# EAGLE design mLRS-rx-WioE5-E22-dual-v008 (EAGLE 7.5.0)
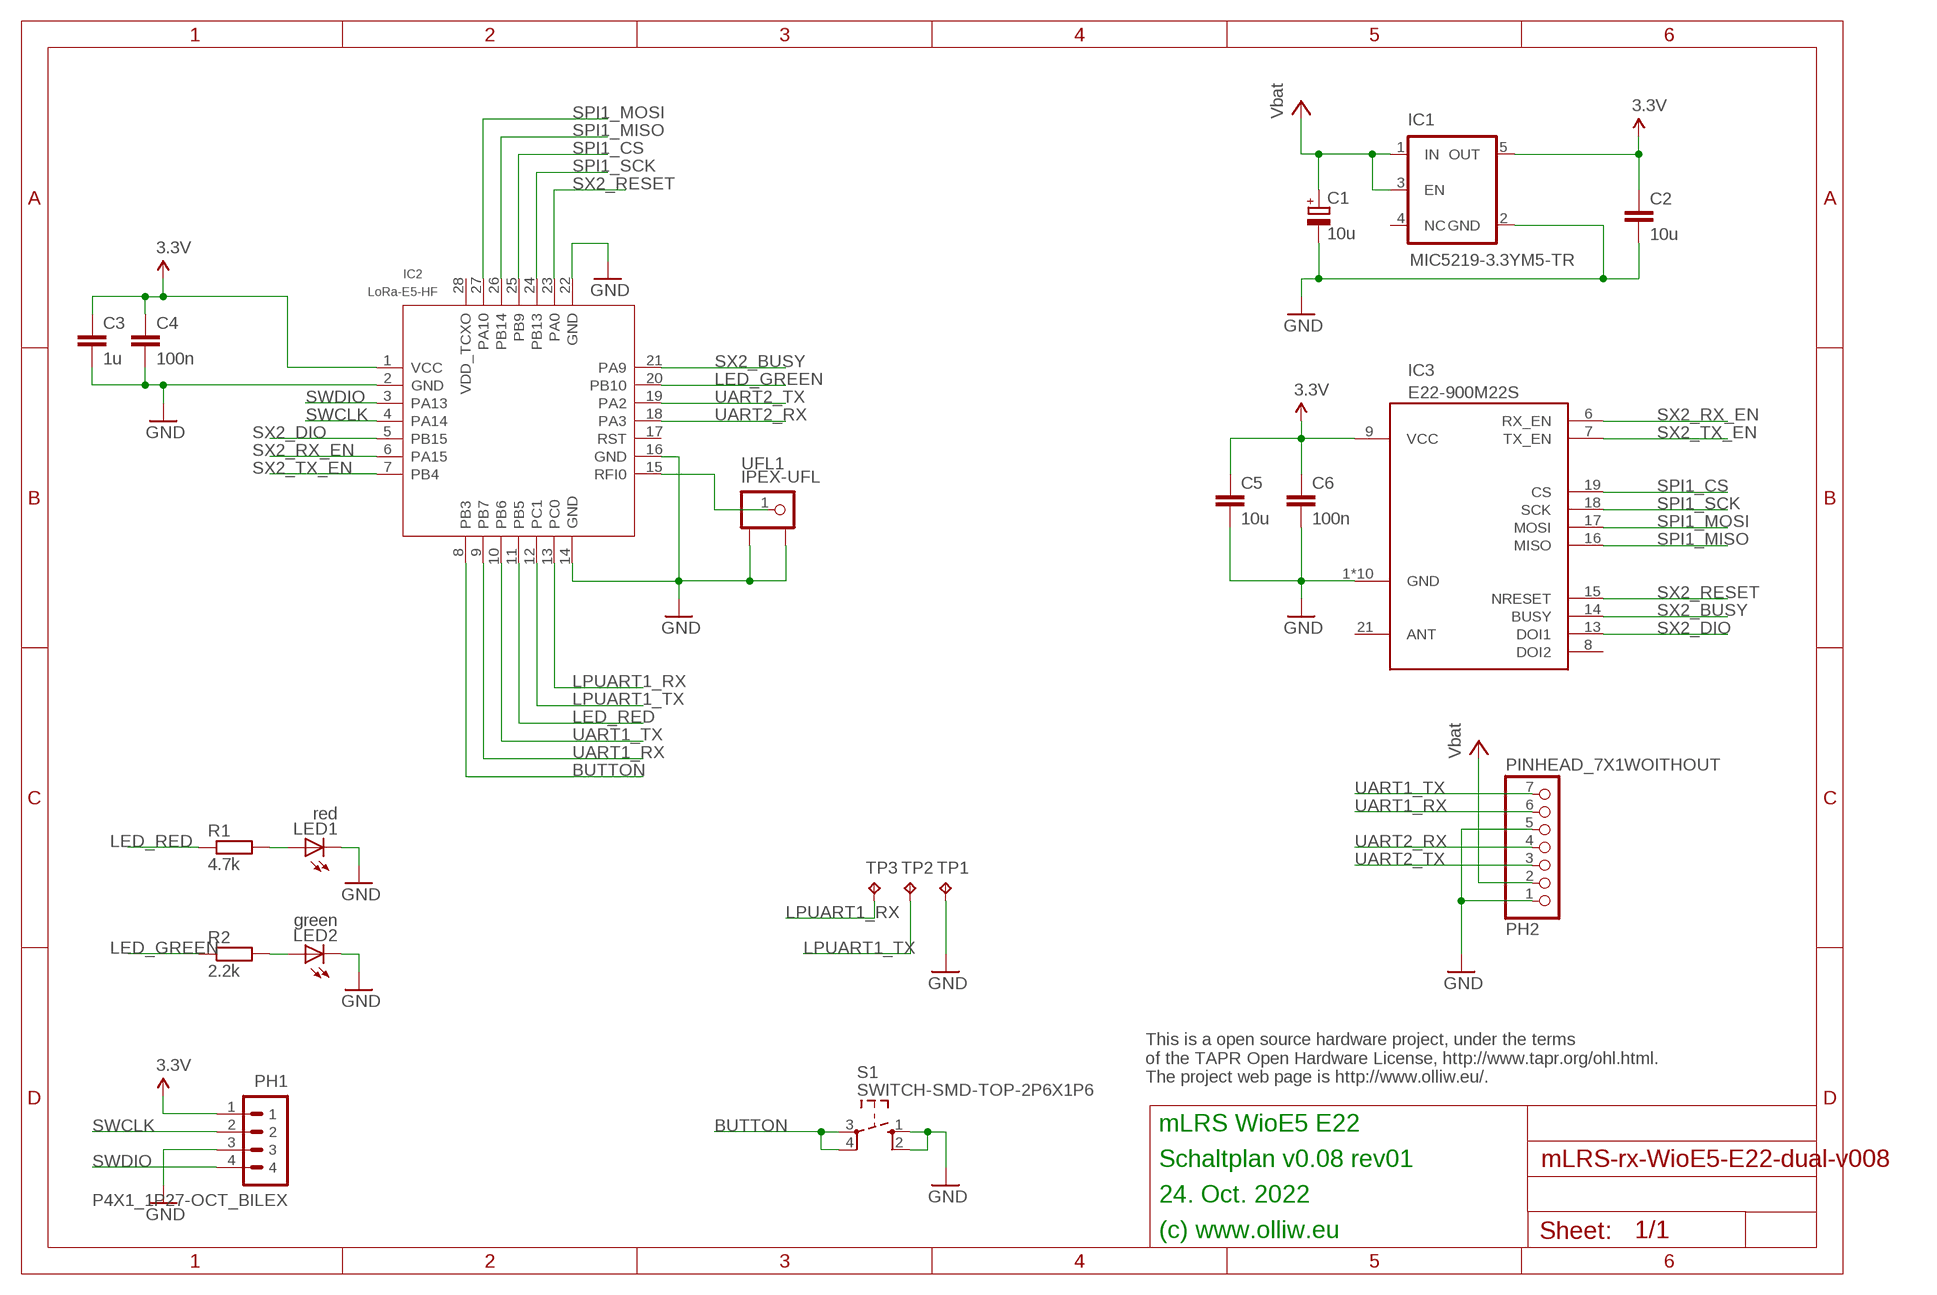
[diagram p0: schematic, sheet 1]

## Parts
C1  10u  CPOL-EUSMCA  [SMC_A]
C2  10u  C-EUC0805  [C0805]
C3  1u  C-EUC0603K  [C0603K]
C4  100n  C-EUC0402  [C0402]
C5  10u  C-EUC0805K  [C0805K]
C6  100n  C-EUC0402  [C0402]
IC1  MIC5219-3.3YM5-TR  V_REG_TPS76433SOT23-5  [SOT23-5]
IC2  LoRa-E5-HF  MOUDLE_LORA_E5  [MOUDLE28P-1.25-12X12X2.5MM]
IC3  E22-900M22S  [E22-900M22S]
LED1  red  LEDCHIPLED_0603  [CHIPLED_0603]
LED2  green  LEDCHIPLED_0603  [CHIPLED_0603]
PH1  P4X1_1P27-OCT_BILEX  [4X1_1P27_OCT_BILEX]
PH2  PINHEAD_7X1WOITHOUT  [PINHEAD_7X1_WO]
R1  4.7k  R-EU_R0402  [R0402]
R2  2.2k  R-EU_R0402  [R0402]
S1  SWITCH-SMD-TOP-2P6X1P6  [TACTILE-SWITCH-SMD-TOP-2P6X1X6]
TP1  TPB1,27  [B1,27]
TP2  TPB1,27  [B1,27]
TP3  TPB1,27  [B1,27]
UFL1  IPEX-UFL  [IPEX-UFL-SMD]

## Nets
3.3V: C2.1 C3.1 C4.1 C5.1 C6.1 IC1.5(OUT) IC2.1(VCC) IC3.9(VCC) PH1.1
BUTTON: IC2.8(PB3) S1.3 S1.4
GND: C1.- C2.2 C3.2 C4.2 C5.2 C6.2 IC1.2(GND) IC2.2(GND) IC2.14(GND) IC2.16(GND) IC2.22(GND) IC3.1(GND) IC3.2(GND) IC3.3(GND) IC3.4(GND) IC3.5(GND) IC3.10(GND) IC3.11(GND) IC3.12(GND) IC3.20(GND) IC3.22(GND) LED1.C LED2.C PH1.3 PH2.1 PH2.5 S1.1 S1.2 TP1.TP UFL1.2 UFL1.3
LED_GREEN: IC2.20(PB10) R2.1
LED_RED: IC2.11(PB5) R1.1
LPUART1_RX: IC2.13(PC0) TP3.TP
LPUART1_TX: IC2.12(PC1) TP2.TP
N$1: IC2.15(RFI0) UFL1.1
N$17: LED1.A R1.2
N$19: LED2.A R2.2
SPI1_CS: IC2.25(PB9) IC3.19(CS)
SPI1_MISO: IC2.26(PB14) IC3.16(MISO)
SPI1_MOSI: IC2.27(PA10) IC3.17(MOSI)
SPI1_SCK: IC2.24(PB13) IC3.18(SCK)
SWCLK: IC2.4(PA14) PH1.2
SWDIO: IC2.3(PA13) PH1.4
SX2_BUSY: IC2.21(PA9) IC3.14(BUSY)
SX2_DIO: IC2.5(PB15) IC3.13(DOI1)
SX2_RESET: IC2.23(PA0) IC3.15(NRESET)
SX2_RX_EN: IC2.6(PA15) IC3.6(RX_EN)
SX2_TX_EN: IC2.7(PB4) IC3.7(TX_EN)
UART1_RX: IC2.9(PB7) PH2.6
UART1_TX: IC2.10(PB6) PH2.7
UART2_RX: IC2.18(PA3) PH2.4
UART2_TX: IC2.19(PA2) PH2.3
VCC: C1.+ IC1.1(IN) IC1.3(EN) PH2.2 ; supply symbol labelled Vbat
Unconnected: IC1.4(NC) IC2.17(RST) IC2.28(VDD_TCXO) IC3.8(DOI2) IC3.21(ANT)

## Notes on the sheet
- This is a open source hardware project, under the terms
  of the TAPR Open Hardware License, http://www.tapr.org/ohl.html.
  The project web page is http://www.olliw.eu/.
- mLRS WioE5 E22
- Schaltplan v0.08 rev01
- 24. Oct. 2022
- (c) www.olliw.eu

## Library data of the parts
C1 = rcl:CPOL-EU: POLARIZED CAPACITOR, European symbol
C2-C6 = rcl:C-EU: CAPACITOR, European symbol
IC1 = # SparkFun2:V_REG_TPS76433: Voltage Regulator Older TI part. LDO 150mA regulator. No output by-pass cap option. See V_REG_LDO for a better part.
IC2 = moudle-new:MOUDLE_LORA_E5
IC3 = # stdlib:E22-900M22S
LED1 LED2 = led:LED: LED OSRAM: - CHIPLED LG R971, LG N971, LY N971, LG Q971, LY Q971, LO R971, LY R971 LH N974, LH R974 LS Q976, LO Q976, LY Q976 LO Q996 - Hyper CHIPLED LW Q18S LB Q993, LB Q99A, LB R99A - SideLED LS A670, LO A670, LY A670, LG A670, LP A670 LB A673, LV A673, LT A673, LW A673 LH A674 LY A675 LS A676, LA A676, LO A676, LY A676, LW A676 LS A679, LY A679, LG A679 - Hyper Micro SIDELED® LS Y876, LA Y876, LO Y876, LY Y876 LT Y87S - SmartLED LW L88C, LW L88S LB L89C, LB L89S, LG L890 LS L89K, LO L89K, LY L89K LS L896, LA L896, LO L896, LY L896 - TOPLED LS T670, LO T670, LY T670, LG T670, LP T670 LSG T670, LSP T670, LSY T670, LOP T670, LYG T670 LG T671, LOG T671, LSG T671 LB T673, LV T673, LT T673, LW T673 LH T674 LS T676, LA T676, LO T676, LY T676, LB T676, LH T676, LSB T676, LW T676 LB T67C, LV T67C, LT T67C, LS T67K, LO T67K, LY T67K, LW E67C LS E67B, LA E67B, LO E67B, LY E67B, LB E67C, LV E67C, LT E67C LW T67C LS T679, LY T679, LG T679 LS T770, LO T770, LY T770, LG T770, LP T770 LB T773, LV T773, LT T773, LW T773 LH T774 LS E675, LA E675, LY E675, LS T675 LS T776, LA T776, LO T776, LY T776, LB T776 LHGB T686 LT T68C, LB T68C - Hyper Mini TOPLED® LB M676 - Mini TOPLED Santana® LG M470 LS M47K, LO M47K, LY M47K Source: http://www.osram.convergy.de LUXEON: - LUMILED® LXK2-PW12-R00, LXK2-PW12-S00, LXK2-PW14-U00, LXK2-PW14-V00 LXK2-PM12-R00, LXK2-PM12-S00, LXK2-PM14-U00 LXK2-PE12-Q00, LXK2-PE12-R00, LXK2-PE12-S00, LXK2-PE14-T00, LXK2-PE14-U00 LXK2-PB12-K00, LXK2-PB12-L00, LXK2-PB12-M00, LXK2-PB14-N00, LXK2-PB14-P00, LXK2-PB14-Q00 LXK2-PR12-L00, LXK2-PR12-M00, LXK2-PR14-Q00, LXK2-PR14-R00 LXK2-PD12-Q00, LXK2-PD12-R00, LXK2-PD12-S00 LXK2-PH12-R00, LXK2-PH12-S00 LXK2-PL12-P00, LXK2-PL12-Q00, LXK2-PL12-R00 Source: www.luxeon.com KINGBRIGHT: KA-3528ASYC Source: www.kingbright.com
PH1 = # stdlib:P4X1_1P27
PH2 = # stdlib:PINHEAD_7X1
R1 R2 = rcl:R-EU_: RESISTOR, European symbol
S1 = # stdlib:SWITCH-SMD-TOP-2P6X1P6
TP1-TP3 = testpad:TP: Test pad
UFL1 = # stdlib:IPEX-UFL

## Board
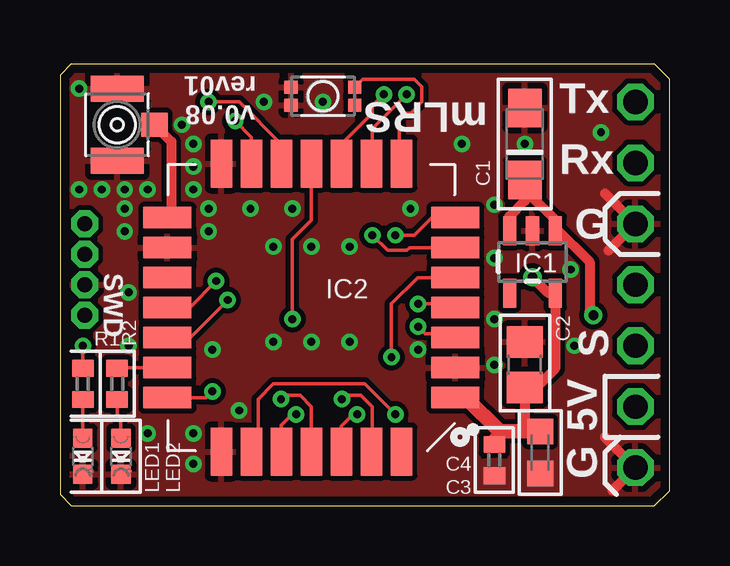
[diagram p1: board, top side]
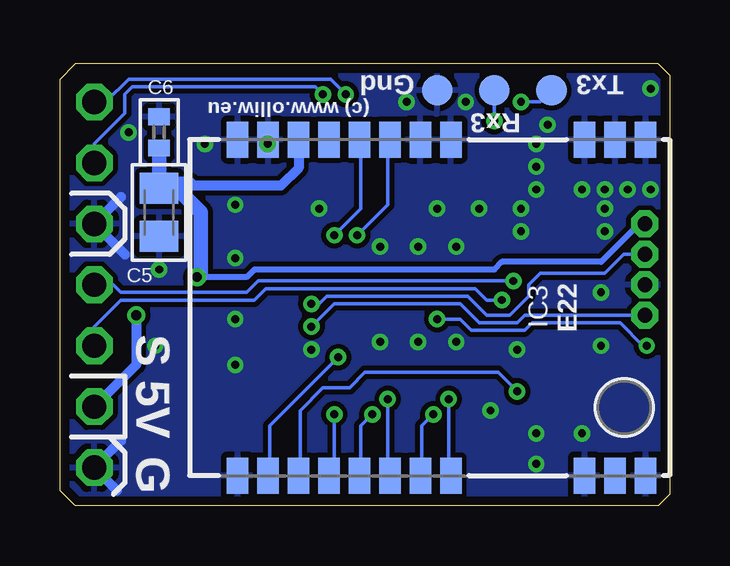
[diagram p2: board, bottom side, seen from below]

Size 25.4 x 18.41 mm. Coordinates in mm from the lower left corner, seen from the top.
Outline: 24.77,0 25.4,0.63 25.4,17.78 24.77,18.41 0.48,18.41 0,17.94 0,0.48 0.48,0 24.77,0
Copper layers (1*16): Top 0.0356mm / dielectric 1.5011mm / Bottom 0.0356mm
Design rules "ow-oshpark-2layer": minimum track width 6mil, minimum drill 13mil, track to track 6mil, track to pad 6mil, pad to pad 6mil, via to via 6mil, smd to smd 6mil, copper to edge 15mil, drill to drill 6mil, minimum pad ring 7mil, minimum via ring 7mil, stop-mask expansion 2.5mil, vias tented up to drill 26mil, thermal gap 10mil

### Footprints (pad centres in the part's own frame; a part is rotated, then mirrored left to right if it is on the bottom)
SMC_A = smd 1.6 x 1.4: + -1.5,0; - 1.5,0
C0805 = smd 1.3 x 1.5: 1 -0.95,0; 2 0.95,0
C0603K = smd 1.05 x 1.08: 1 -0.875,0; 2 0.875,0
C0402 = smd 0.7 x 0.9: 1 -0.65,0; 2 0.65,0
C0805K = smd 1.3 x 1.6: 1 -1,0; 2 1,0
SOT23-5 = smd 0.55 x 1.2: 1 -0.95,-1.3; 2 0,-1.3; 3 0.95,-1.3; 4 0.95,1.3; 5 -0.95,1.3
MOUDLE28P-1.25-12X12X2.5MM = smd 2 x 0.9: 1 -6,3.75; 2 -6,2.5; 3 -6,1.25; 4 -6,0; 5 -6,-1.25; 6 -6,-2.5; 7 -6,-3.75; 15 6,-3.75; 16 6,-2.5; 17 6,-1.25; 18 6,0; 19 6,1.25; 20 6,2.5; 21 6,3.75 | smd 0.9 x 2: 8 -3.75,-6; 9 -2.5,-6; 10 -1.25,-6; 11 0,-6; 12 1.25,-6; 13 2.5,-6; 14 3.75,-6; 22 3.75,6; 23 2.5,6; 24 1.25,6; 25 0,6; 26 -1.25,6; 27 -2.5,6; 28 -3.75,6
E22-900M22S = smd 1.5 x 0.9: 1 -7,9; 2 -7,7.73; 3 -7,6.46; 4 -7,0.89; 5 -7,-0.38; 6 -7,-1.65; 7 -7,-2.92; 8 -7,-4.19; 9 -7,-5.46; 10 -7,-6.73; 11 -7,-8; 12 7,-8; 13 7,-6.73; 14 7,-5.46; 15 7,-4.19; 16 7,-2.92; 17 7,-1.65; 18 7,-0.38; 19 7,0.89; 20 7,6.46; 21 7,7.73; 22 7,9
CHIPLED_0603 = smd 0.8 x 0.8: A 0,-0.75; C 0,0.75
4X1_1P27_OCT_BILEX = drill 0.61 pad 1.118 octagon: 1 0,0; 2 0,-1.27; 3 0,-2.54; 4 0,-3.81
PINHEAD_7X1_WO = drill 1.016 octagon: 1 0,0; 2 0,-2.54; 3 0,-5.08; 4 0,-7.62; 5 0,-10.16; 6 0,-12.7; 7 0,-15.24
R0402 = smd 0.7 x 0.9: 1 -0.65,0; 2 0.65,0
TACTILE-SWITCH-SMD-TOP-2P6X1X6 = smd 0.55 x 0.55: 1 -1.325,0.375; 2 -1.325,-0.375; 3 1.325,-0.375; 4 1.325,0.375
B1,27 = smd 1.27 x 1.27: TP 0,0
IPEX-UFL-SMD = smd 1 x 1.1: 1 0,-1.55 | smd 1.1 x 2.2: 2 -1.5,0; 3 1.5,0

### Placement (x,y rotation side)
C1  19.37,15.08 90 top
C2  19.37,5.87 90 top
C3  20,2.22 270 top
C4  18.1,1.91 270 top
C5  21.27,12.22 270 bottom
C6  21.27,15.56 90 bottom
IC1  19.68,10.16 180 top
IC2  10.48,8.26 180 top
IC3  10,8.26 270 bottom
LED1  0.95,2.06 180 top
LED2  2.54,2.06 180 top
PH1  1.03,11.75 0 top
PH2  23.97,1.59 180 top
R1  0.95,5.08 270 top
R2  2.38,5.08 270 top
S1  10.95,17.07 0 top
TP1  9.68,17.3 0 bottom
TP2  4.92,17.3 0 bottom
TP3  7.3,17.3 0 bottom
UFL1  2.38,15.87 90 top

### Tracks (layer width: path | path; a pad name or v marks a point on that pad's centre or on a via)
3.3V  (via drill 0.4)
  Top 0.406: C3.1 19.92,3.18 19.37,3.18 C2.1 19.84,4.92 20.63,5.71 IC1.5 20.35,8.86 v19.68,9.53 | IC2.1 16.91,4.51 | C4.1 18.1,2.86 18.32,3.1
  Top 0.61: C3.1 18.32,3.1 16.91,4.51
  Bottom 0.254: PH1.1 1.27,11.75 2.86,10.16 6.99,10.16 7.3,9.84 17.3,9.84 17.62,9.53 v19.68,9.53
  Bottom 0.406: 21.38,13.02 C5.1 21.27,13.49 20,13.49 19.84,13.33 16.19,13.33 15.46,14.07 IC3.9
  Bottom 0.61: C6.1 21.27,13.49 | v19.68,9.53 19.53,9.68 19.53,12.22 20.32,13.02 21.38,13.02
BUTTON
  Top 0.152: S1.3 S1.4 12.62,17.78 14.76,17.78 15.08,17.46 15.08,16.83 14.61,16.35 14.29,16.35 14.13,16.19 14.13,14.6 14.16,14.26 IC2.8
GND  (via drill 0.33)
  Top 0.406: 22.7,2.86 PH2.1 23.02,0.63 | 22.7,13.02 PH2.5 22.86,10.64
  Bottom 0.406: 22.86,2.7 PH2.1 23.02,0.63 | 22.86,12.86 PH2.5 22.7,10.48
  other vias: 2.86,8.89 10.95,16.83 21.27,9.84 21.43,6.67 18.1,7.78 18.1,5.87 14.92,6.51 18.1,12.54 14.61,12.38 10.48,10.79 6.19,11.43 2.86,6.67 6.35,6.51 7.46,3.97 5.56,3.02 5.56,1.75 19.37,15.08 22.54,15.56 5.56,15.08 5.56,13.18 3.65,13.18 1.75,13.18 0.79,13.18 2.7,13.18 5.08,15.87 5.56,14.13 0.79,17.38 6.19,12.38 8.49,16.83 18.1,10.32 12.07,6.83 10.48,6.83 9.68,12.38 3.65,3.02 7.94,12.38 12.07,10.79 8.89,6.83 2.7,12.38 16.75,15.08 8.89,10.79 2.7,11.43
  pour Bottom (isolate 0.203, rank 6): 0.16,18.26 25.08,18.26 25.08,0.16 0.16,0.16
  pour Top (isolate 0.203, rank 6): 0.16,18.26 25.08,18.26 25.08,0.16 0.16,0.16
  pour Top (no thermals): 17.3,1.59 17.62,1.91 18.89,1.91 19.21,2.22 21.11,2.22 21.11,0.32 17.3,0.32
LED_GREEN
  Top 0.152: IC2.20 2.41,5.76 R2.1
LED_RED  (via drill 0.33)
  Top 0.152: v9.68,7.78 9.68,11.11 10.48,11.91 IC2.11 | v0.95,6.67 R1.1
  Bottom 0.152: v9.68,7.78 8.73,7.78 8.26,7.3 6.03,7.3 5.71,7.62 2.06,7.62 1.11,6.67 v0.95,6.67
LPUART1_RX  (via drill 0.33)
  Top 0.152: IC2.13 7.98,15.36 v7.3,16.03
  Bottom 0.152: v7.3,16.03 TP3.TP
LPUART1_TX  (via drill 0.33)
  Top 0.152: IC2.12 9.23,15.06 7.46,16.83 v6.19,16.83
  Bottom 0.152: v6.19,16.83 5.4,16.83 TP2.TP
N$1
  Top 0.406: UFL1.1 4.64,15.17 4.64,12.16 IC2.15
N$17
  Top 0.152: R1.2 LED1.A
N$19
  Top 0.152: R2.2 2.38,3.81 2.54,3.65 LED2.A
SPI1_CS  (via drill 0.33)
  Top 0.152: IC2.25 10.48,4.13 10,4.6 9.37,4.6 v9.21,4.45
  Bottom 0.152: v9.21,4.45 9.21,1.35 IC3.19
SPI1_MISO  (via drill 0.33)
  Top 0.152: IC2.26 11.73,3.31 12.22,3.81 v12.38,3.81
  Bottom 0.152: v12.38,3.81 12.86,3.33 12.86,1.32 IC3.16
SPI1_MOSI  (via drill 0.33)
  Top 0.152: IC2.27 12.98,2.98 13.02,3.02 13.02,4.13 12.54,4.6 11.91,4.6 v11.75,4.45
  Bottom 0.152: v11.75,4.45 11.75,1.35 IC3.17
SPI1_SCK  (via drill 0.33)
  Top 0.152: IC2.24 9.23,3.35 9.68,3.81 v9.84,3.81
  Bottom 0.152: v9.84,3.81 10.32,3.33 10.32,1.32 IC3.18
SWCLK  (via drill 0.33)
  Top 0.152: IC2.4 15.88,8.41 v14.92,8.41
  Bottom 0.152: v14.92,8.41 14.61,8.41 14.29,8.73 8.41,8.73 7.62,7.94 6.67,7.94 5.87,8.73 5.87,9.21 5.4,9.68 2.7,9.68 1.91,10.48 PH1.2
SWDIO  (via drill 0.33)
  Top 0.152: IC2.3 16.19,7.14 16.17,7.16 15.22,7.16 v14.92,7.46
  Bottom 0.152: v14.92,7.46 13.97,8.41 8.73,8.41 7.94,7.62 6.35,7.62 6.03,7.94 PH1.4
SX2_BUSY  (via drill 0.33)
  Top 0.152: IC2.21 6.09,4.51 v6.35,4.76
  Bottom 0.152: IC3.14 15.4,1.32 15.4,3.97 14.45,4.92 13.34,4.92 12.7,5.56 7.14,5.56 v6.35,4.76
SX2_DIO  (via drill 0.33)
  Top 0.152: IC2.5 14.9,9.51 13.81,8.41 v13.81,6.19
  Bottom 0.152: v13.81,6.19 16.67,3.33 16.67,1.32 IC3.13
SX2_RESET  (via drill 0.33)
  Top 0.152: v13.97,3.81 12.7,5.08 8.89,5.08 8.26,4.45 8.26,2.54 IC2.23
  Bottom 0.152: v13.97,3.81 13.97,1.75 14.13,1.32 IC3.15
SX2_RX_EN  (via drill 0.33)
  Top 0.152: IC2.6 14.56,10.76 14.45,10.64 13.65,10.64 v13.02,11.27
  Bottom 0.152: v13.02,11.27 11.75,12.54 11.75,15.16 IC3.6
SX2_TX_EN  (via drill 0.33)
  Top 0.152: IC2.7 15.5,12.01 14.76,11.27 v13.97,11.27
  Bottom 0.152: v13.97,11.27 12.86,12.38 12.86,15.32 IC3.7
UART1_RX  (via drill 0.33)
  Top 0.152: IC2.9 13.02,14.29 13.02,15.72 v14.45,17.15
  Bottom 0.152: v14.45,17.15 14.76,17.46 22.38,17.46 22.7,17.15 22.7,16.35 23.97,15.08 PH2.6
UART1_TX  (via drill 0.33)
  Top 0.152: IC2.10 11.75,14.28 11.75,15.08 13.02,16.35 13.02,16.67 v13.49,17.15
  Bottom 0.152: v13.49,17.15 14.13,17.78 22.54,17.78 23.49,16.83 PH2.7
UART2_RX  (via drill 0.33)
  Top 0.152: IC2.18 5.4,8.26 v6.51,9.37
  Bottom 0.152: PH2.4 23.18,9.21 22.86,8.89 17.62,8.89 17.14,9.37 v6.51,9.37
UART2_TX  (via drill 0.33)
  Top 0.152: IC2.19 4.5,6.98 5.4,6.98 v6.99,8.57
  Bottom 0.152: PH2.3 23.97,7.46 22.86,8.57 17.3,8.57 16.83,9.05 8.1,9.05 7.62,8.57 v6.99,8.57
VCC  (via drill 0.4)
  Top 0.406: 20.63,11.59 22.07,10.16 22.07,8.1 v22.22,7.94 | IC1.1 20.63,11.59 | 20.63,11.59 20.63,11.91 19.68,12.86 19.61,13.33 C1.+ 19.37,12.7 18.73,12.07 IC1.3
  Bottom 0.406: v22.22,7.94 22.22,5.87 PH2.2

### Text on the board
tNames: mLRS | v0.08 / rev01 | Tx | Rx | G | SWD | S | 5V | G
bNames: Tx3 | Gnd | (c) www.olliw.eu | Rx3 | E22 | S | 5V | G